# Altium schematic sheet SignalFilters.SchDoc
size A
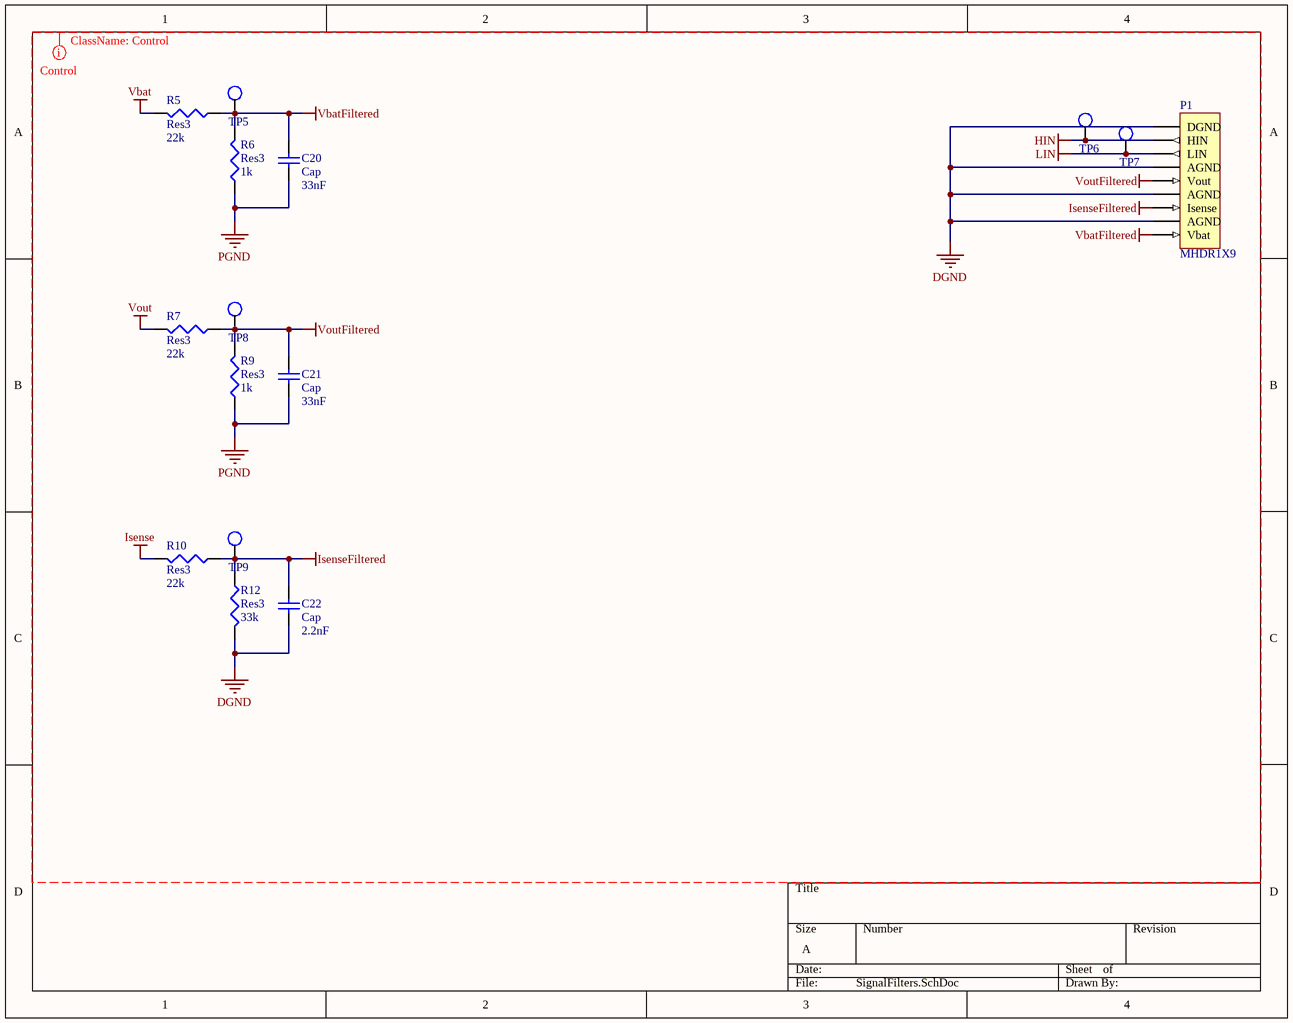
[diagram p0: SignalFilters.SchDoc]

## Parts
C20  Cap  value 33nF  [C0603]
C21  Cap  value 33nF  [C0603]
C22  Cap  value 2.2nF  [C0603]
P1  MHDR1X9  [MHDR1X9]
R5  Res3  value 22k  [J1-0603]
R6  Res3  value 1k  [J1-0603]
R7  Res3  value 22k  [J1-0603]
R9  Res3  value 1k  [J1-0603]
R10  Res3  value 22k  [J1-0603]
R12  Res3  value 33k  [J1-0603]
TP5  Test Point  [Test Point - TH]  (value not drawn)
TP6  Test Point  [Test Point - TH]  (value not drawn)
TP7  Test Point  [Test Point - TH]  (value not drawn)
TP8  Test Point  [Test Point - TH]  (value not drawn)
TP9  Test Point  [Test Point - TH]  (value not drawn)

## Nets
DGND: C22.1 P1.1(DGND) P1.4(AGND) P1.6(AGND) P1.8(AGND) R12.2
HIN: P1.2(HIN) TP6.1
Isense: R10.2
IsenseFiltered: C22.2 P1.7(Isense) R10.1 R12.1 TP9.1
LIN: P1.3(LIN) TP7.1
PGND: C20.1 C21.1 R6.1 R9.1
Vbat: R5.2
VbatFiltered: C20.2 P1.9(Vbat) R5.1 R6.2 TP5.1
Vout: R7.2
VoutFiltered: C21.2 P1.5(Vout) R7.1 R9.2 TP8.1

## Layout directives
net class Control: DGND, HIN, Isense, IsenseFiltered, LIN, PGND, Vbat, VbatFiltered, Vout, VoutFiltered

## Library data of the parts
C20-C22 = Cap: Capacitor; Published: 8-Jun-2000; LatestRevisionDate: 17-Jul-2002; LatestRevisionNote: Re-released for DXP Platform.; PackageReference: RAD-0.3; Publisher: Altium Limited; PackageDescription: Radial Cap, Thru-Hole; 2 Leads; 0.3 in Pin Spacing
P1 = MHDR1X9: Header, 9-Pin; LatestRevisionDate: 17-Jul-2002; LatestRevisionNote: Re-released for DXP Platform.; Publisher: Altium Limited
R5-R7 R9 R10 R12 = Res3: Resistor; Published: 8-Jun-2000; LatestRevisionDate: 29-May-2009; LatestRevisionNote: IPC-7351 Footprint Added.; PackageReference: J1-0603; Publisher: Altium Limited; PackageDescription: Chip Resistor